# Altium schematic sheet DRV8825 stepper motor controller.SchDoc: DRV8825
size A4; CompanyName: James Cook University; DrawnBy: CC2511 AS2 Group 1; Organization: James Cook University; Revision: 1.0; SheetNumber: 2; SheetTotal: 4; ProjectName: *ProjectName
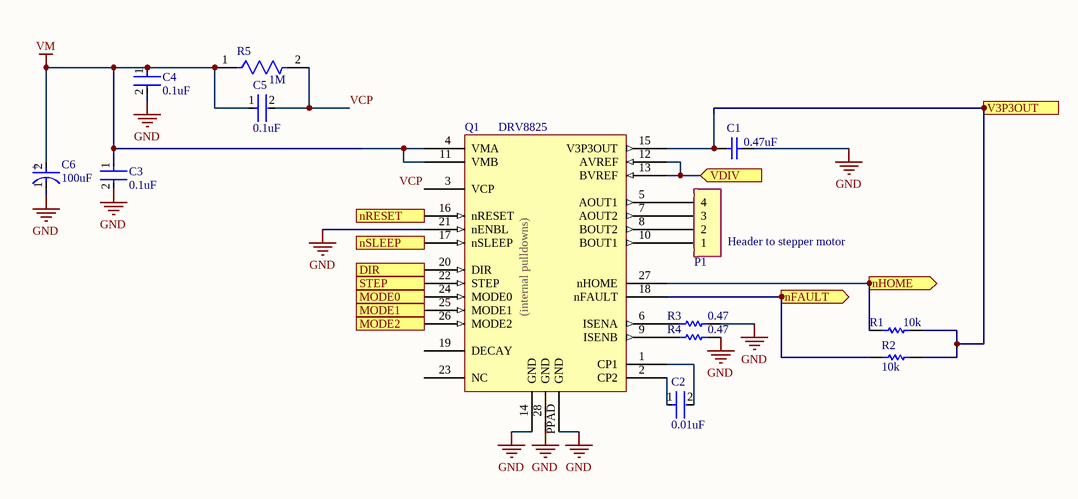
[diagram p0: DRV8825 stepper motor controller.SchDoc]

## Parts
C1  0.47uF  [CAPC2013X140X50ML20T25]
C2  0.01uF  [FP-0805-L_2_01_0_2-W_1_25-IPC_B]
C3  0.1uF  [FP-0805-L_2_01_0_2-W_1_25-IPC_C]
C4  0.1uF  [FP-0805-L_2_01_0_2-W_1_25-IPC_C]
C5  0.1uF  [FP-0805-L_2_01_0_2-W_1_25-IPC_C]
C6  100uF  [FP-FKE-MFG]
P1  Header to stepper motor  [B4B-XH-A (LF)(SN)]
Q1  DRV8825  [DRV8825 HTSSOP]
R1  10k  [RESC2013X60X35ML10T20]
R2  10k  [RESC2013X60X35ML10T20]
R3  0.47  [RESC2013X65X40ML15T20]
R4  0.47  [RESC2013X65X40ML15T20]
R5  1M  [FP-CRCW0805-e3-IPC_B]

## Ports
DIR (in), MODE0 (in), MODE1 (in), MODE2 (in), nFAULT (out), nHOME (out), nRESET (in), nSLEEP (in), STEP (in), V3P3OUT (out), VDIV (in)

## Nets
GND: C1.2 C3.2 C4.2 C6.1(C) Q1.14(GND) Q1.21(nENBL) Q1.28(GND) Q1.PPAD(GND) R3.2 R4.2
VM: C3.1 C4.1 C5.1 C6.2(A) Q1.4(VMA) Q1.11(VMB) R5.1
DIR: Q1.20(DIR) ; port DIR
MODE0: Q1.24(MODE0) ; port MODE0
MODE1: Q1.25(MODE1) ; port MODE1
MODE2: Q1.26(MODE2) ; port MODE2
nFAULT: Q1.18(nFAULT) R2.2 ; port nFAULT
nHOME: Q1.27(nHOME) R1.1 ; port nHOME
nRESET: Q1.16(nRESET) ; port nRESET
nSLEEP: Q1.17(nSLEEP) ; port nSLEEP
STEP: Q1.22(STEP) ; port STEP
V3P3OUT: C1.1 Q1.15(V3P3OUT) R1.2 R2.1 ; port V3P3OUT
VCP: C5.2 Q1.3(VCP) R5.2
VDIV: Q1.12(AVREF) Q1.13(BVREF) ; port VDIV
NetC2_1: C2.1 Q1.2(CP2)
NetC2_2: C2.2 Q1.1(CP1)
NetP1_1: P1.1 Q1.10(BOUT1)
NetP1_2: P1.2 Q1.8(BOUT2)
NetP1_3: P1.3 Q1.7(AOUT2)
NetP1_4: P1.4 Q1.5(AOUT1)
NetQ1_6: Q1.6(ISENA) R3.1
NetQ1_9: Q1.9(ISENB) R4.1

Not connected (* = marked no-connect by the designer): Q1 19(DECAY) 23(NC)

## Notes on the sheet
- Date:
- Sheet
- of
- Time:
- Revision:
- Drawn by:
- File:
- (in symbol CMP-2000-06205-2) +
- (in symbol Stepper motor driver DRV8825) (internal pulldowns)

## Library data of the parts
C1 = CMP-2007-03309-1: Part Number: C0805F474K3RACTU; Manufacturer: Kemet
C2 = CMP-2007-04361-2: General Purpose Ceramic Capacitor, 0805, 10nF, 5%, X7R, 0.15, 50V; Insulation Resistance: 100GR; Dissipation Factor: 2.5%; Series: -; Case Code (Imperial): 0805; Voltage Rating (DC): 50V; Dielectric: X7R; Voltage Rating: 50V; Lead Free: Lead Free; Max Operating Temperature: 125°C; Depth: 1.25mm; Termination: SMD/SMT; Number of Pins: 2; Dielectric Material: Ceramic; Capacitance: 10nF; Case/Package: 0805; Contact Plating: Tin; Mount: Surface Mount; Height: 0.71mm; Package Quantity: 1; Packaging: Tape and Reel; Construction: Flat; RoHS Compliant: Yes; Voltage: 50V; Case Code (Metric): 2012; REACH SVHC: No SVHC; Tolerance: 5%; Radiation Hardening: No; Width: 0.049inch; Thickness: 0.037inch; Length: 2.01mm; Min Operating Temperature: -55°C
C3-C5 = CMP-2000-05016-2: General Purpose Ceramic Capacitor, 0805, 100nF, 10%, X7R, 0.15, 50V; Dissipation Factor: 2.5%; Insulation Resistance: 100GR; Voltage Rating (DC): 50V; Package Quantity: 4000; Tolerance: 10%; Voltage Rating: 50V; Dielectric: X7R; Case/Package: 0805; Lead Free: Lead Free; Dielectric Material: Ceramic; Thickness: 0.037inch; Weight: 0.001411oz; Max Operating Temperature: 125°C; REACH SVHC: No SVHC; Mount: Surface Mount; RoHS Compliant: Yes; Depth: 1.25mm; Height: 0.5mm; Case Code (Metric): 2012; Length: 2mm; Termination: Standard; Case Code (Imperial): 0805; Number of Pins: 2; Voltage: 50V; Radiation Hardening: No; Min Operating Temperature: -55°C; Capacitance: 100nF; Width: 1.2mm; Series: MLCC X7R; Packaging: Cut Tape
C6 = CMP-2000-06205-2: CAP ALUM 100UF 20% 25V SMD; Ripple Current (AC): 300mA; Leakage Current: 3uA; Dielectric Material: Aluminium; Impedance: 260mR; Life (Hours): 2000Hour; Max Operating Temperature: 105°C; Voltage Rating (DC): 25V; Packaging: Tape and Reel; Min Operating Temperature: -55°C; Capacitance: 100uF; Ripple Current: 300mA; Mount: Surface Mount; Lead Free: Lead Free; Construction: Cylindrical; Voltage Rating: 25V; RoHS Compliant: Yes; Case/Package: Radial; Height: 6.2mm; Tolerance: 20%; Diameter: 8mm; Termination: SMD/SMT; Package Quantity: 1; Width: 8.3mm; REACH SVHC: No SVHC; Series: FK; Number of Pins: 2; Voltage: 25V; Radiation Hardening: No; Height - Seated (Max): 0.244inch; Length: 6.2mm; ESR (Equivalent Series Resistance): 260mR
P1 = B4B-XH-A (LF)(SN) Wire-to-board connector: Wire-to-board connector, vertical, 2.5mm, 4 contacts
Q1 = Stepper motor driver DRV8825: TI DRV8825 Stepper Motor Controller IC
R1 R2 = CMP-2000-05025-1: Chip Resistor, 10 KOhm, +/- 5%, 0.125 W, -55 to 155 degC, 0805 (2012 Metric), RoHS, Tape and Reel; Manufacturer: Yageo; Resistor Element Type: ThickFilm; Voltage Rating: 150V; Product Range: RCSeries; SVHC: ToBeAdvised; Resistor Case Style: 0805[2012Metric]; Temperature Coefficient: ±100ppm/degC; Power Rating: 250mW; Resistance: 10kohm; Automotive Qualification Standard: -; Datasheet Version: REV. 2, 09/2004; Packaging: CutTape; Resistance Tolerance: ±5%; MSL: MSL1-Unlimited; Manufacturer URL: http://www.yageo.com/; Datasheet URL: http://www.yageo.ru/pdf/RC0805.pdf; Package Description: 2-Pin Surface Mounted Device, Body 2 x 1.25 mm; Package Reference: 805
R3 R4 = CMP-2001-04359-1: Part Number: RCWE0805R470FKEA; Manufacturer: Vishay Dale
R5 = CMP-2001-03630-2: RES Thick Film, 1MΩ, 1%, 0.125W, 100ppm/°C, 0805; Voltage Rating (DC): 150V; Resistance: 1MR; Power Rating: 125mW; Packaging: Tape and Reel; Case Code (Metric): 2012; Case/Package: 0805; Width: 1.25mm; Mount: Surface Mount; Military Standard: Not; Radiation Hardening: No; Weight: 0.000194oz; Package Quantity: 5000; Max Operating Temperature: 155°C; Contact Plating: Tin; Composition: Thick Film; Number of Pins: 2; Tolerance: 1%; Termination: SMD/SMT; Case Code (Imperial): 0805; Depth: 1.25mm; Temperature Coefficient: 100ppm/°C; Min Operating Temperature: -55°C; Height: 0.45mm; Lead Free: Lead Free; Length: 2mm; Voltage Rating: 150V